# EAGLE schematic untitled (EAGLE 9.6.2)
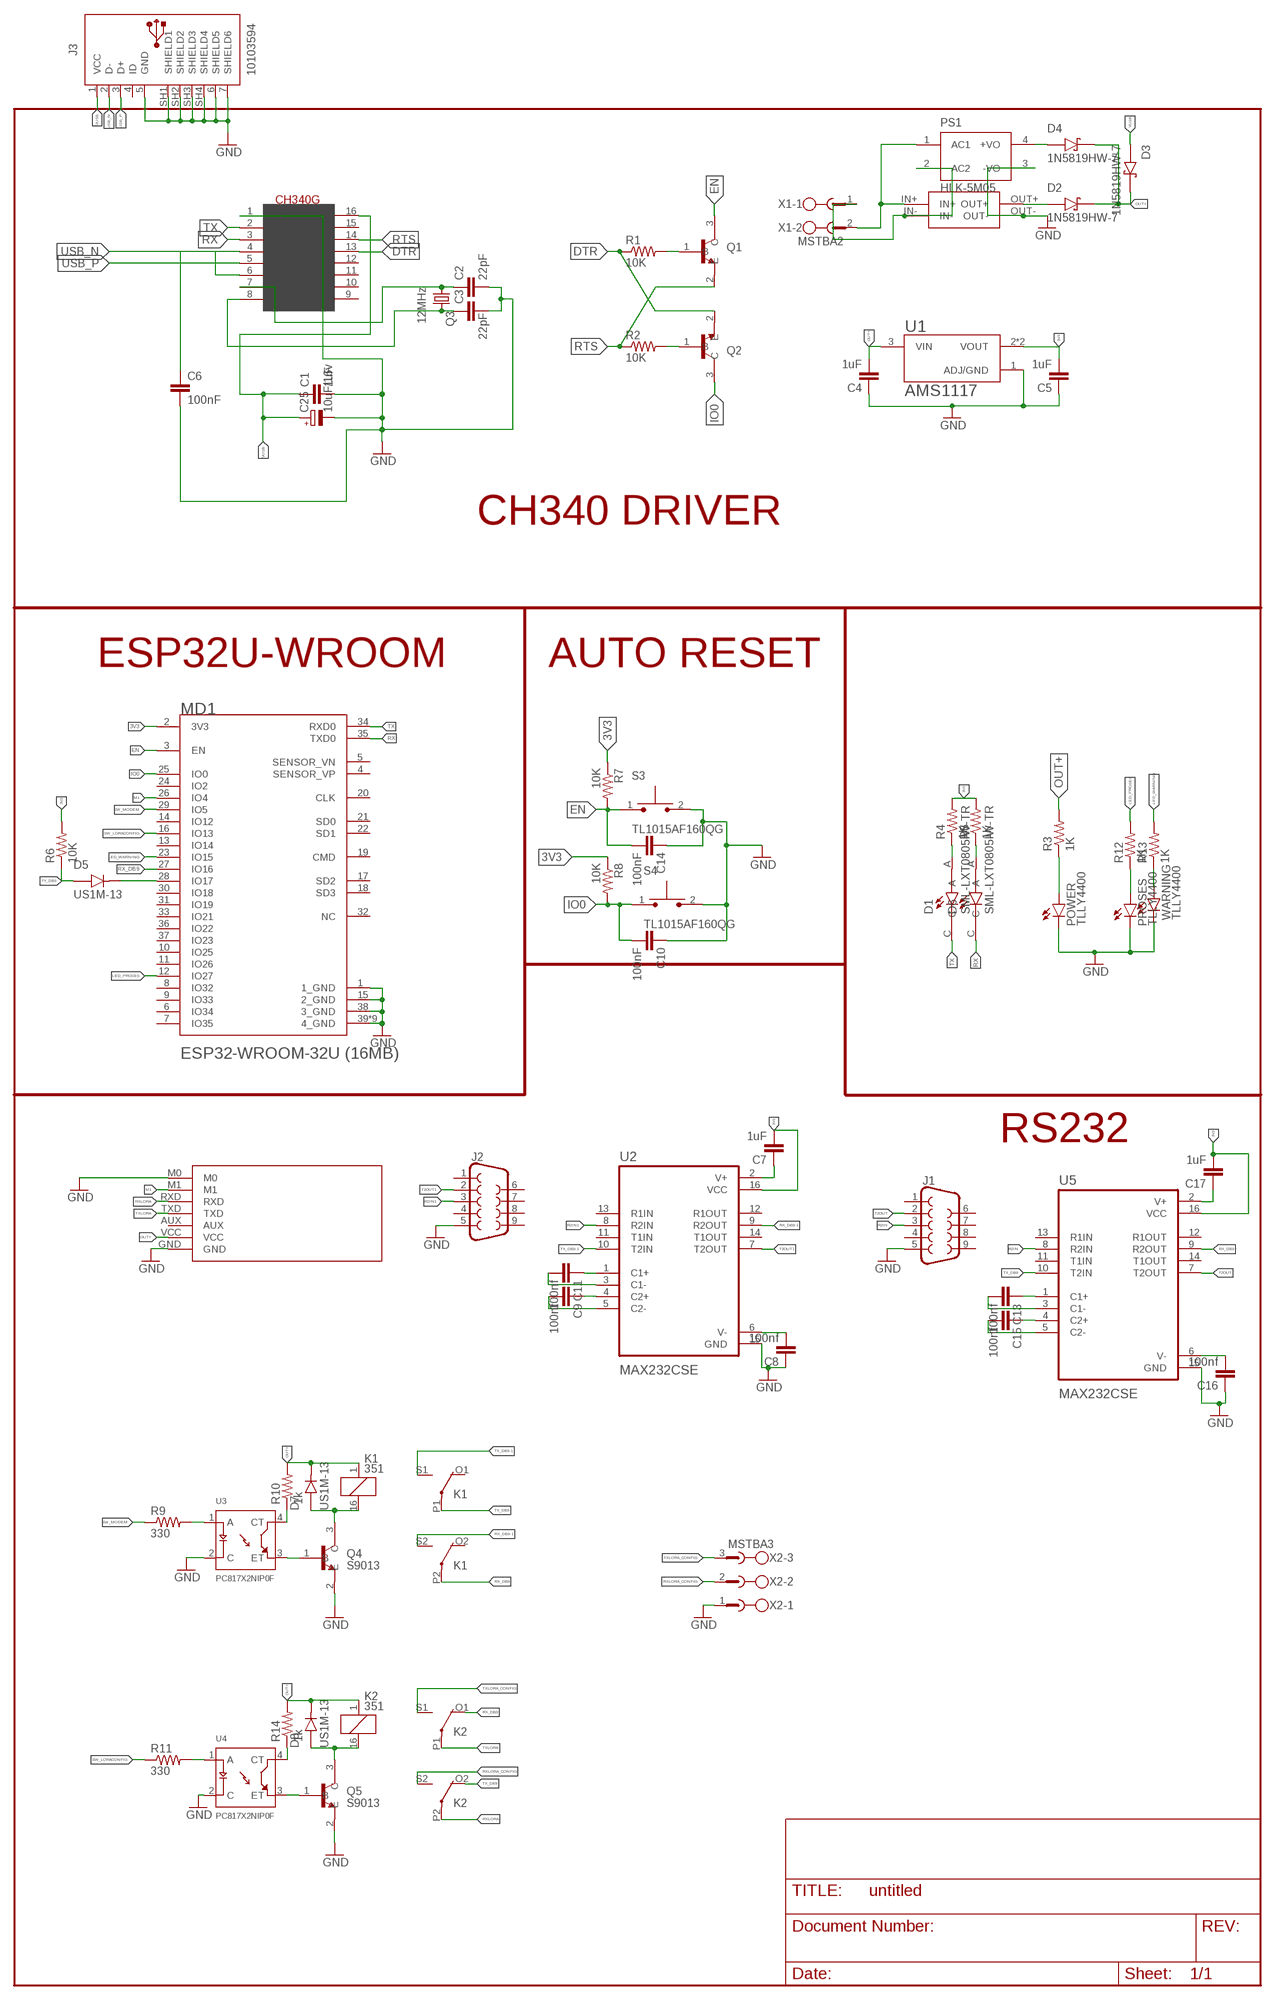
[diagram p0: schematic, sheet 1]

## Parts
C1  1uF  C-EUC0805K  [C0805K]
C2  22pF  C-EUC0805K  [C0805K]
C3  22pF  C-EUC0805K  [C0805K]
C4  1uF  C-EUC0805K  [C0805K]
C5  1uF  C-EUC0805K  [C0805K]
C6  100nF  C-EUC0805K  [C0805K]
C7  1uF  C-EUC0805  [C0805]
C8  100nf  C-EUC0805  [C0805]
C9  100nf  C-EUC0805  [C0805]
C10  100nF  C-EUC0805K  [C0805K]
C11  100nf  C-EUC0805  [C0805]
C13  100nf  C-EUC0805  [C0805]
C14  100nF  C-EUC0805K  [C0805K]
C15  100nf  C-EUC0805  [C0805]
C16  100nf  C-EUC0805  [C0805]
C17  1uF  C-EUC0805  [C0805]
C25  10uF/16v  CPOL-EU153CLV-0505  [153CLV-0505]
D1  SML-LXT0805IW-TR  [LEDC2012X120N]
D2  1N5819HW-7  [SOD3715X145N]
D3  1N5819HW-7  [SOD3715X145N]
D4  1N5819HW-7  [SOD3715X145N]
D5  US1M-13  [DIOM5226X240N]
D6  SML-LXT0805IW-TR  [LEDC2012X120N]
D7  US1M-13  [DIOM5226X240N]
D8  US1M-13  [DIOM5226X240N]
EBYTEE220-900T22D1  EBYTEE220-900T22D  [EBYTEE220-900T22D]
J1  DB9MALE  [DB9_MALE]
J2  DB9MALE  [DB9_MALE]
J3  10103594  [10103594]
K1  351  [351]
K2  351  [351]
MD1  ESPRESSIF_SYSTEMS_ESP32-WROOM-32U_16MBESPRESSIF_SYSTEMS_ESP32-WROOM-32U_16MB_0_0  [ESPRESSIF_SYSTEMS_ESP32-WROOM-32U_16MB_0]
MINI1  MINI560  [MINI560]
POWER  TLLY4400  [LED3MM]
PROSES  TLLY4400  [LED3MM]
PS1  HLK-5M05  [CONV_HLK-5M05]
Q1  MMBT3904  [SOT95P240X120-3N]
Q2  MMBT3904  [SOT95P240X120-3N]
Q3  12MHz  CRYSTALSM49  [SM49]
Q4  S9013  [SOT95P240X120-3N]
Q5  S9013  [SOT95P240X120-3N]
R1  10K  R-US_M0805  [M0805]
R2  10K  R-US_M0805  [M0805]
R3  1K  R-US_M0805  [M0805]
R4  1K  R-US_M0805  [M0805]
R5  1K  R-US_M0805  [M0805]
R6  10K  R-US_M0805  [M0805]
R7  10K  R-US_M0805  [M0805]
R8  10K  R-US_M0805  [M0805]
R9  330  R-US_M0805  [M0805]
R10  1k  R-US_M0805  [M0805]
R11  330  R-US_M0805  [M0805]
R12  1K  R-US_M0805  [M0805]
R13  1K  R-US_M0805  [M0805]
R14  1k  R-US_M0805  [M0805]
S3  TL1015AF160QG  [SW_TL1015AF160QG]
S4  TL1015AF160QG  [SW_TL1015AF160QG]
U1  AMS1117  [SOT229P700X180-4N]
U2  MAX232CSE  [SOIC127P600X175-16N]
U3  PC817X2NIP0F  [SOT254P975X400-4N]
U4  PC817X2NIP0F  [SOT254P975X400-4N]
U5  MAX232CSE  [SOIC127P600X175-16N]
U$2  CH340G  [SOIC16]
WARNING  TLLY4400  [LED3MM]
X1  MSTBA2  [MSTBA2]
X2  MSTBA3  [MSTBA3]

## Nets
3V3: C5.2 C7.2 C17.2 MD1.2(3V3) R4.2 R5.2 R6.2 R7.1 R8.1 U1.2(VOUT) U1.4(VOUT) U2.16(VCC) U5.16(VCC)
DTR: Q2.2(E) R1.1 U$2.13(DTR)
EN: C14.2 MD1.3(EN) Q1.3(C) R7.2 S3.1
GND: C1.2 C2.2 C3.2 C4.1 C5.1 C6.2 C8.1 C10.1 C14.1 C16.1 C25.- EBYTEE220-900T22D1.GND EBYTEE220-900T22D1.M0 J1.5 J2.5 J3.5(GND) J3.6(SHIELD5) J3.7(SHIELD6) J3.SH1(SHIELD1) J3.SH2(SHIELD2) J3.SH3(SHIELD3) J3.SH4(SHIELD4) MD1.1(1_GND) MD1.15(2_GND) MD1.38(3_GND) MD1.39(4_GND) MD1.39-2(4_GND) MD1.39-3(4_GND) MD1.39-4(4_GND) MD1.39-5(4_GND) MD1.39-6(4_GND) MD1.39-7(4_GND) MD1.39-8(4_GND) MD1.39-9(4_GND) MINI1.OUT- POWER.K(C) PROSES.K(C) PS1.3(-VO) Q4.2(E) Q5.2(E) S3.2 S4.2 U1.1(ADJ/GND) U2.15(GND) U3.2(C) U4.2(C) U5.15(GND) U$2.1(GND) WARNING.K(C) X2.1
IO0: C10.2 MD1.25(IO0) Q2.3(C) R8.2 S4.1
LED_PROSES: MD1.12(IO27) R12.2
LED_WARNING: MD1.23(IO15) R13.2
M1: EBYTEE220-900T22D1.M1 MD1.26(IO4)
N$1: C2.1 Q3.1 U$2.7(XI)
N$2: C3.1 Q3.2 U$2.8(XO)
N$3: POWER.A R3.1
N$4: Q1.1(B) R1.2
N$5: Q2.1(B) R2.2
N$6: MINI1.IN+ PS1.1(AC1) X1.2
N$7: C7.1 U2.2(V+)
N$8: D1.A R4.1
N$9: D6.A R5.1
N$10: C13.1 U5.1(C1+)
N$11: D2.A MINI1.OUT+
N$12: C6.1 U$2.4(V3)
N$13: D5.C(K) MD1.28(IO17)
N$14: C13.2 U5.3(C1-)
N$15: R9.2 U3.1(A)
N$16: R10.1 U3.4(CT)
N$17: C8.2 U2.6(V-)
N$18: Q4.1(B) U3.3(ET)
N$19: C15.1 U5.4(C2+)
N$20: C9.1 U2.4(C2+)
N$21: C9.2 U2.5(C2-)
N$22: C11.2 U2.3(C1-)
N$23: C11.1 U2.1(C1+)
N$24: C15.2 U5.5(C2-)
N$25: PROSES.A R12.1
N$26: C17.1 U5.2(V+)
N$27: C16.2 U5.6(V-)
N$28: R13.1 WARNING.A
N$29: D7.A K1.16 Q4.3(C)
N$30: R11.2 U4.1(A)
N$31: R14.1 U4.4(CT)
N$33: D8.A K2.16 Q5.3(C)
N$34: MINI1.IN- PS1.2(AC2) X1.1
N$35: D4.A PS1.4(+VO)
N$36: Q5.1(B) U4.3(ET)
OUT+: C4.2 D2.C(K) D3.C(K) D4.C(K) D7.C(K) D8.C(K) EBYTEE220-900T22D1.VCC K1.1 K2.1 R3.2 R10.2 R14.2 U1.3(VIN)
R2IN: J1.3 U5.8(R2IN)
R2IN1: J2.3 U2.8(R2IN)
RTS: Q1.2(E) R2.1 U$2.14(RTS)
RX: D6.C MD1.35(TXD0) U$2.3(RX)
RX_DB9: K1.P2(3:P) K2.O1(2:O) MD1.27(IO16) U5.9(R2OUT)
RX_DB9-1: K1.S2(3:S) U2.9(R2OUT)
RXLORA: EBYTEE220-900T22D1.RXD K2.P2(3:P)
RXLORA_CONFIG: K2.S2(3:S) X2.2
SW_LORACONFIG: MD1.16(IO13) R11.1
SW_MODEM: MD1.29(IO5) R9.1
T2OUT: J1.2 U5.7(T2OUT)
T2OUT1: J2.2 U2.7(T2OUT)
TX: D1.C MD1.34(RXD0) U$2.2(TX)
TX_DB9: D5.A K1.P1(2:P) K2.O2(3:O) R6.1 U5.10(T2IN)
TX_DB9-1: K1.S1(2:S) U2.10(T2IN)
TXLORA: EBYTEE220-900T22D1.TXD K2.P1(2:P)
TXLORA_CONFIG: K2.S1(2:S) X2.3
USB_N: J3.2(D-) U$2.6(D-)
USB_P: J3.3(D+) U$2.5(D+)
VUSB: C1.1 C25.+ D3.A J3.1(VCC) U$2.16(VCC)
Unconnected: EBYTEE220-900T22D1.AUX J1.1 J1.4 J1.6 J1.7 J1.8 J1.9 J2.1 J2.4 J2.6 J2.7 J2.8 J2.9 J3.4(ID) K1.O1(2:O) K1.O2(3:O) MD1.4(SENSOR_VP) MD1.5(SENSOR_VN) MD1.6(IO34) MD1.7(IO35) MD1.8(IO32) MD1.9(IO33) MD1.10(IO25) MD1.11(IO26) MD1.13(IO14) MD1.14(IO12) MD1.17(SD2) MD1.18(SD3) MD1.19(CMD) MD1.20(CLK) MD1.21(SD0) MD1.22(SD1) MD1.24(IO2) MD1.30(IO18) MD1.31(IO19) MD1.32(NC) MD1.33(IO21) MD1.36(IO22) MD1.37(IO23) U2.11(T1IN) U2.12(R1OUT) U2.13(R1IN) U2.14(T1OUT) U5.11(T1IN) U5.12(R1OUT) U5.13(R1IN) U5.14(T1OUT) U$2.9(CTS) U$2.10(DSR) U$2.11(RI) U$2.12(DCD) U$2.15(RS232)

## Notes on the sheet
- CH340 DRIVER
- ESP32U-WROOM | AUTO RESET
- RS232

## Library data of the parts
C1-C11 C13-C17 = rcl:C-EU: CAPACITOR, European symbol; SPICEPREFIX: C
C25 = rcl:CPOL-EU: POLARIZED CAPACITOR, European symbol; SPICEPREFIX: C
D1 D6 = SML-LXT0805IW-TR:SML-LXT0805IW-TR: LED; Luminous Intensity:11µcd; Viewing Angle:140°; Forward Current:30mA; Forward Voltage:2V; Color:Red; LED Color:Red; Leaded Process Compatible:Yes; Lens Color:White; Mounting Type:Surface Mount ;RoHS Compliant: Yes Check availability <https://pricing.snapeda.com/parts/SML-LXT0805IW-TR/Lumex%20Opto/Components/view-part?ref=eda>; AVAILABILITY: In Stock; DESCRIPTION: Red - LED Indication - Discrete 2V 0805 (2012 Metric); MF: Lumex Opto/Components; MP: SML-LXT0805IW-TR; PACKAGE: 0805 Lumex; PRICE: None; PURCHASE-URL: https://pricing.snapeda.com/search/part/SML-LXT0805IW-TR/?ref=eda
D2-D4 = 1N5819HW-7:1N5819HW-7: 1N5819HW Series 40 V 1 A Surface Mount Schottky Barrier Rectifier - SOD-123 Check availability <https://pricing.snapeda.com/parts/1N5819HW-7/Diodes%20Inc./view-part?ref=eda>; AVAILABILITY: In Stock; DESCRIPTION: Diode Schottky 40 V 1A Surface Mount SOD-123; MF: Diodes Inc.; MP: 1N5819HW-7; PACKAGE: SOD-123 Fairchild Semiconductor; PRICE: None; PURCHASE-URL: https://pricing.snapeda.com/search/part/1N5819HW-7/?ref=eda
D5 D7 D8 = US1M-13:US1M-13: Diode, Fast Recovery, 1a, 1kv, Do-214ac-2, Full Reel Check availability <https://pricing.snapeda.com/parts/US1M-13/Diodes%20Incorporated/view-part?ref=eda>; AVAILABILITY: In Stock; DESCRIPTION: Diode Standard 1000 V 1A Surface Mount SMA; MF: Diodes Incorporated; MP: US1M-13; PACKAGE: DO-214AC-214 Diodes Incorporated; PRICE: None; PURCHASE-URL: https://pricing.snapeda.com/search/part/US1M-13/?ref=eda
EBYTEE220-900T22D1 = EByte E220-900T22D:EBYTEE220-900T22D
J1 J2 = SparkFun-Connectors:DB9: DB9 Connector Standard DB9 (D-Sub 9) serial connector. Can be used for CAN bus as well as RS485 and RS232. Footprint production proven. Here is the female version connector we sell at SparkFun: 9 Pin Female Serial Connector - PCB Mount <https://www.sparkfun.com/products/429> (PRT-00429) This connector has been used on the following SparkFun products: SparkFun RS232 Shifter - SMD <https://www.sparkfun.com/products/449> (PRT-00449) SparkFun RS232 Shifter SMD (No DB9) <https://www.sparkfun.com/products/8780> (PRT-08780); PROD_ID: CONN-09904
J3 = Connector_USB:10103594: USB(2.0) Micro-B, RCPT, 5POS, SMD-THT-R/A Datasheet <https://cdn.amphenol-icc.com/media/wysiwyg/files/documentation/datasheet/inputoutput/io_usb_micro.pdf> Drawing <https://cdn.amphenol-icc.com/media/wysiwyg/files/drawing/10103594.pdf>; CATEGORY: Connectors; CONTACTS: 5; CURRENT-RATING: 1.8A; DESCRIPTION: CONN RCPT USB2.0 MICRO B SMD R/A; GENDER: Receptacle; MANUFACTURER: Amphenol ICC (FCI); MOUNT_TYPE: R/A; MPN: 10103594-0001LF; OPERATING_TEMPERATURE: -30°C ~ 80°C; PART_STATUS: ACTIVE; ROHS_COMPLIANT: COMPLIANT; SUB_CATEGORY: USB; TYPE: USB-micro B; VOLTAGE-RATING: 100VAC
K1 K2 = relay:351: RELAY 2 x switch, Omron; OC_FARNELL: unknown; OC_NEWARK: unknown
MD1 = Espressif Systems - ESP32-WROOM-32U (16MB):ESPRESSIF_SYSTEMS_ESP32-WROOM-32U_16MB: Bluetooth, WiFi 802.11b/g/n, Bluetooth v4.2 +EDR, Class 1, 2 and 3 Transceiver Module 2.4GHz ~ 2.5GHz Antenna Not Included, U.FL Surface Mount; AUTOMOTIVE: No; BANDWIDTH: 72MHz; CENTROID_NOT_SPECIFIED: No; DATASHEET: https://www.espressif.com/sites/default/files/documentation/esp32-wroom-32d_esp32-wroom-32u_datasheet_en.pdf; DATA_RATE: 150Mbits/s; DEVICE_CLASS_L1: Integrated Circuits (ICs); DEVICE_CLASS_L2: RF Semiconductors and Devices; DEVICE_CLASS_L3: Transceivers; DIGIKEY_DESCRIPTION: RX TXRX MODULE WIFI U.FL SMD; DIGIKEY_PART_NUMBER: 1904-1028-1-ND; FOOTPRINT_VARIANT_NAME_0: Recommended_Land_Pattern; HEIGHT: 3.35mm; INTERFACE: I2C,SPI,UART,Ethernet,I2S,Other; LEAD_FREE: Yes; MAX_FREQUENCY: 2484MHz; MAX_SUPPLY_VOLTAGE: 3.6V; MF: Espressif Systems; MFG_PACKAGE_IDENT: 0; MFG_PACKAGE_IDENT_DATE: 0; MFG_PACKAGE_IDENT_REV: 0; MIN_SUPPLY_VOLTAGE: 3V; MOUSER_PART_NUMBER: 356-ES32WROOM32U16MB; MPN: ESP32-WROOM-32U (16MB); NOMINAL_SUPPLY_CURRENT: 0.5A; NUMBER_OF_ADC_CHANNELS: 16; NUMBER_OF_GPIO: 26; PACKAGE: BT_MODULE; PREFIX: MD; ROHS: Yes; SENSITIVITY: -98dBm; TEMPERATURE_RANGE_HIGH: +85°C; TEMPERATURE_RANGE_LOW: -40°C; VERIFICATION_VERSION: 0.0.0.3
MINI1 = MINI560:MINI560
POWER PROSES WARNING = led:TLLY4400: Low Current (2mA) LED 3 mm Tinted Diffused Package color YELLOW Source: Data sheet <http://www.farnell.com/datasheets/391098.pdf>; MF: VISHAY SEMICONDUCTOR; OC_FARNELL: 1612439
PS1 = HLK-5M05:HLK-5M05: AC DC 220V to 5V 5W 5Watt Isolated Switching Step-Down Power Supply Module Converter Check availability <https://pricing.snapeda.com/parts/HLK-5M05/Hi-link/view-part?ref=eda>; AVAILABILITY: Not in stock; MF: Hi-link; MP: HLK-5M05; PACKAGE: Package; PRICE: None
Q1 Q2 = MMBT3904:MMBT3904: MMBT3904 Series 40 V CE Breakdown 0.2 A NPN General Purpose Amplifier - SOT-23 Check availability <https://pricing.snapeda.com/parts/MMBT3904/STMicroelectronics/view-part?ref=eda>; AVAILABILITY: Not in stock; DESCRIPTION: SMD Transistor MMBT3904 SOT-23 SMD DIOTEC; MF: STMicroelectronics; MP: MMBT3904; PACKAGE: SOT-23 ON; PRICE: None
Q3 = adafruit:CRYSTAL: CRYSTAL; OC_FARNELL: unknown; OC_NEWARK: unknown
Q4 Q5 = S9013:S9013: SMD Transistors NPN 25V-500mA Check availability <https://pricing.snapeda.com/parts/S9013/JCET/view-part?ref=eda>; AVAILABILITY: In Stock; DESCRIPTION: Bipolar (BJT) Transistor NPN 20V 500mA 625mW Through Hole TO-92-3; MF: JCET; MP: S9013; PACKAGE: SOT-23-3 JCET; PRICE: None; PURCHASE-URL: https://pricing.snapeda.com/search/part/S9013/?ref=eda
R1-R14 = adafruit:R-US_: RESISTOR, American symbol
S3 S4 = TL1015AF160QG:TL1015AF160QG: Tactile Switch SPST-NO Top Actuated Surface Mount Check availability <https://pricing.snapeda.com/parts/TL1015AF160QG/E-Switch/view-part?ref=eda>; AVAILABILITY: In Stock; DESCRIPTION: Tactile Switch SPST-NO Top Actuated Surface Mount; MF: E-Switch; MP: TL1015AF160QG; PACKAGE: None; PRICE: None; PURCHASE-URL: https://pricing.snapeda.com/search/part/TL1015AF160QG/?ref=eda
U1 = AMS1117:AMS1117: Sot223/Pkg 1-Amp 5-Volt Low Drop Out Voltage Regulatator Check availability <https://pricing.snapeda.com/parts/AMS1117/Advanced%20Monolithic%20Systems/view-part?ref=eda>; AVAILABILITY: Not in stock; DESCRIPTION: 1A LOW DROPOUT VOLTAGE REGULATOR SOT-223; MF: Advanced Monolithic Systems; MP: AMS1117; PACKAGE: SOT-223 Seeed Technology; PRICE: None
U2 U5 = MAX232CSE:MAX232CSE: Check availability <https://pricing.snapeda.com/parts/MAX232CSE/Maxim%20Integrated/view-part?ref=eda>; AVAILABILITY: In Stock; DESCRIPTION: 2/2 Transceiver Full RS232 16-SOIC; MF: Maxim Integrated; MP: MAX232CSE; PACKAGE: SOIC-16 Maxim Integrated; PRICE: None; PURCHASE-URL: https://pricing.snapeda.com/search/part/MAX232CSE/?ref=eda
U3 U4 = PC817X2NIP0F:PC817X2NIP0F: PC817 Series 1 Channel 80 V 5000 Vrms General Purpose Photocoupler - DIP-4 Check availability <https://pricing.snapeda.com/parts/PC817X2NIP0F/Sharp%20Microelectronics/view-part?ref=eda>; AVAILABILITY: Not in stock; DESCRIPTION: Optoisolator Transistor Output 5000Vrms 1 Channel 4-SMD; MF: Sharp Microelectronics; MP: PC817X2NIP0F; PACKAGE: SMD-4 Sharp Microelectronics; PRICE: None
U$2 = usb-serial:CH340G
X1 = con-phoenix-508:MSTBA2: PHOENIX; MF: FARNELL; MPN: 1757242; OC_FARNELL: 3705171; OC_NEWARK: 71C4161
X2 = con-phoenix-508:MSTBA3: PHOENIX; MF: FARNELL; MPN: 1757255; OC_FARNELL: 3705183; OC_NEWARK: 71C4162

## Net classes
0 default: width 0.2 mm, clearance 0.15 mm